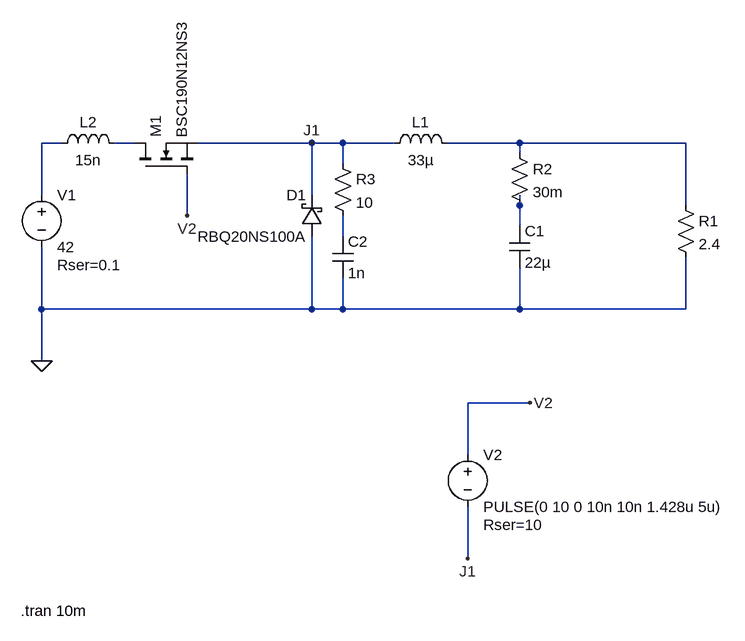
[diagram p0: schematic 60W Buck Converter non ideal case (V2).asc]
60W Buck Converter non ideal case (V2).asc, the LTspice schematic file:
Version 4.1
SHEET 1 880 680
WIRE -432 -368 -464 -368
WIRE -320 -368 -352 -368
WIRE -48 -368 -224 -368
WIRE 0 -368 -48 -368
WIRE 80 -368 0 -368
WIRE 272 -368 160 -368
WIRE 528 -368 272 -368
WIRE 272 -352 272 -368
WIRE 0 -336 0 -368
WIRE -464 -288 -464 -368
WIRE -48 -288 -48 -368
WIRE 272 -272 272 -288
WIRE 528 -272 528 -368
WIRE -240 -256 -240 -320
WIRE 272 -240 272 -272
WIRE 0 -224 0 -256
WIRE -464 -112 -464 -208
WIRE -48 -112 -48 -224
WIRE -48 -112 -464 -112
WIRE 0 -112 0 -160
WIRE 0 -112 -48 -112
WIRE 272 -112 272 -176
WIRE 272 -112 0 -112
WIRE 528 -112 528 -192
WIRE 528 -112 272 -112
WIRE -464 -32 -464 -112
WIRE 288 32 192 32
WIRE 192 112 192 32
WIRE 192 272 192 192
FLAG -240 -256 V2
FLAG -464 -32 0
FLAG -48 -368 J1
FLAG 192 272 J1
FLAG 288 32 V2
SYMBOL voltage -464 -304 R0
WINDOW 123 0 0 Left 0
WINDOW 39 24 124 Left 2
SYMATTR SpiceLine Rser=0.1
SYMATTR InstName V1
SYMATTR Value 42
SYMBOL res 512 -288 R0
SYMATTR InstName R1
SYMATTR Value 2.4
SYMBOL schottky -32 -224 R180
WINDOW 0 24 64 Left 2
WINDOW 3 24 0 Left 2
SYMATTR InstName D1
SYMATTR Value RBQ20NS100A
SYMBOL nmos -320 -320 R270
SYMATTR InstName M1
SYMATTR Value BSC190N12NS3
SYMBOL voltage 192 96 R0
WINDOW 123 0 0 Left 0
WINDOW 39 24 124 Left 2
SYMATTR SpiceLine Rser=10
SYMATTR InstName V2
SYMATTR Value PULSE(0 10 0 10n 10n 1.428u 5u)
SYMBOL ind 64 -352 R270
WINDOW 0 32 56 VTop 2
WINDOW 3 5 56 VBottom 2
SYMATTR InstName L1
SYMATTR Value 33µ
SYMATTR SpiceLine Rser=50m
SYMBOL cap 256 -240 R0
SYMATTR InstName C1
SYMATTR Value 22µ
SYMBOL res 256 -368 R0
SYMATTR InstName R2
SYMATTR Value 30m
SYMBOL ind -448 -352 R270
WINDOW 0 32 56 VTop 2
WINDOW 3 5 56 VBottom 2
SYMATTR InstName L2
SYMATTR Value 15n
SYMATTR SpiceLine Rser=1m
SYMBOL res -16 -352 R0
SYMATTR InstName R3
SYMATTR Value 10
SYMBOL cap -16 -224 R0
SYMATTR InstName C2
SYMATTR Value 1n
TEXT -496 352 Left 2 !.tran 10m

The netlist it stands for:
* 60W Buck Converter non ideal case (V2).asc
V1 N001 0 42 Rser=0.1
R1 N003 0 2.4
D1 0 J1 RBQ20NS100A
M1 N002 V2 J1 J1 BSC190N12NS3
V2 V2 J1 PULSE(0 10 0 10n 10n 1.428u 5u) Rser=10
L1 J1 N003 33µ Rser=50m
C1 N004 0 22µ
R2 N003 N004 30m
L2 N001 N002 15n Rser=1m
R3 J1 N005 10
C2 N005 0 1n
.model D D
.lib standard.dio
.model NMOS NMOS
.model PMOS PMOS
.lib standard.mos
.tran 10m
.backanno
.end